# Altium schematic sheet USB Hub.SchDoc
size A3
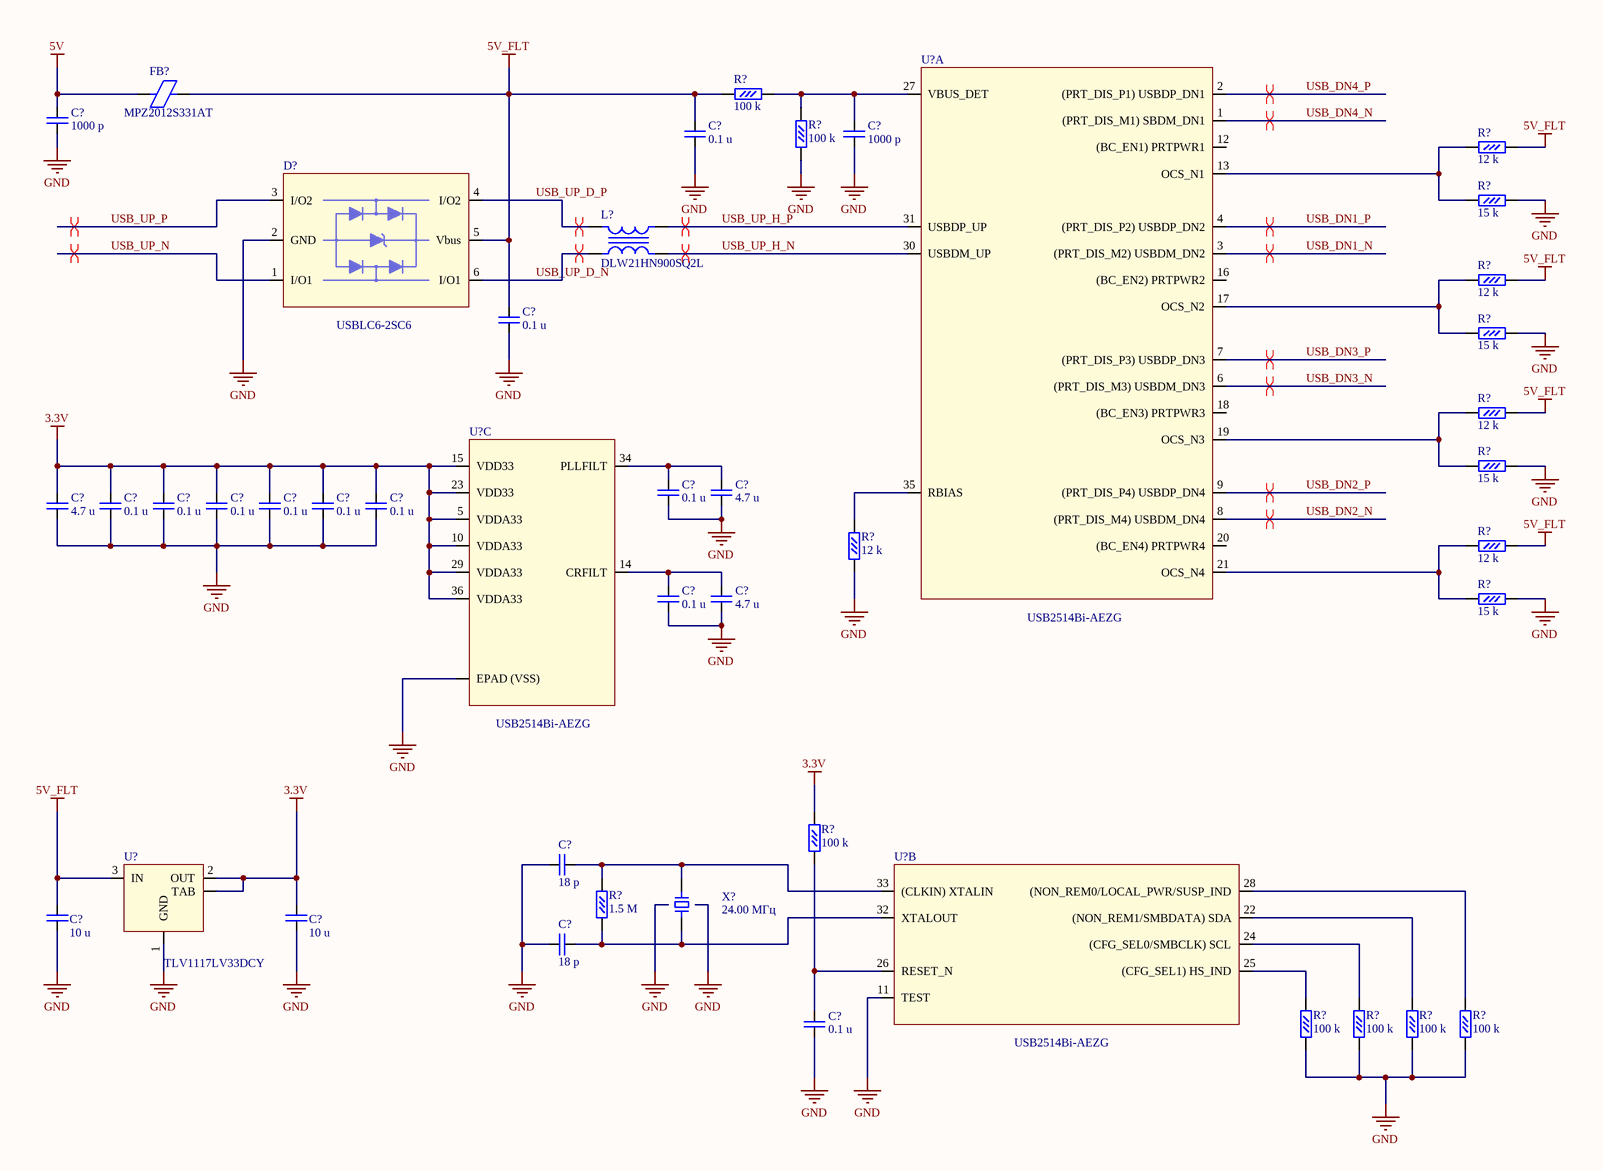
[diagram p0: USB Hub.SchDoc]

## Parts
(Parts that share a designator on the sheet are numbered #1, #2 ... from top to bottom, then left to right.)
C?#1  value 1000 p  [C0402]  (hidden comment: Конденсатор SMD, 1000пФ, X7R, 50В, 10%, 0402)
C?#2  value 0.1 u  [C0402]  (hidden comment: Конденсатор SMD, 0.1мкФ, X5R, 25В, 10%, 0402)
C?#3  value 1000 p  [C0402]  (hidden comment: Конденсатор SMD, 1000пФ, X7R, 50В, 10%, 0402)
C?#4  value 0.1 u  [C0402]  (hidden comment: Конденсатор SMD, 0.1мкФ, X5R, 25В, 10%, 0402)
C?#5  value 0.1 u  [C0402]  (hidden comment: Конденсатор SMD, 0.1мкФ, X5R, 25В, 10%, 0402)
C?#6  value 4.7 u  [C0805]  (hidden comment: Конденсатор SMD, 4.7мкФ, X5R, 50В, 10%, 0805)
C?#7  value 4.7 u  [C0805]  (hidden comment: Конденсатор SMD, 4.7мкФ, X5R, 50В, 10%, 0805)
C?#8  value 0.1 u  [C0402]  (hidden comment: Конденсатор SMD, 0.1мкФ, X5R, 25В, 10%, 0402)
C?#9  value 0.1 u  [C0402]  (hidden comment: Конденсатор SMD, 0.1мкФ, X5R, 25В, 10%, 0402)
C?#10  value 0.1 u  [C0402]  (hidden comment: Конденсатор SMD, 0.1мкФ, X5R, 25В, 10%, 0402)
C?#11  value 0.1 u  [C0402]  (hidden comment: Конденсатор SMD, 0.1мкФ, X5R, 25В, 10%, 0402)
C?#12  value 0.1 u  [C0402]  (hidden comment: Конденсатор SMD, 0.1мкФ, X5R, 25В, 10%, 0402)
C?#13  value 0.1 u  [C0402]  (hidden comment: Конденсатор SMD, 0.1мкФ, X5R, 25В, 10%, 0402)
C?#14  value 0.1 u  [C0402]  (hidden comment: Конденсатор SMD, 0.1мкФ, X5R, 25В, 10%, 0402)
C?#15  value 4.7 u  [C0805]  (hidden comment: Конденсатор SMD, 4.7мкФ, X5R, 50В, 10%, 0805)
C?#16  value 18 p  [C0402]  (hidden comment: Конденсатор SMD, 18пФ, NP0, 50В, 5%, 0402)
C?#17  value 10 u  [C0805]  (hidden comment: Конденсатор SMD, 10мкФ, X5R, 25В, 10%, 0805)
C?#18  value 10 u  [C0805]  (hidden comment: Конденсатор SMD, 10мкФ, X5R, 25В, 10%, 0805)
C?#19  value 18 p  [C0402]  (hidden comment: Конденсатор SMD, 18пФ, NP0, 50В, 5%, 0402)
C?#20  value 0.1 u  [C0402]  (hidden comment: Конденсатор SMD, 0.1мкФ, X5R, 25В, 10%, 0402)
D?  Диод, USBLC6-2SC6  [SOT23-6L]  (value not drawn)
FB?  Фильтр ЭМС, MPZ2012S331AT  [I0805]  (value not drawn)
L?  PartNumber: DLW21HN900SQ2L  [DLW21H]  (hidden comment: Фильтр ЭМС, DLW21HN900SQ2L)
R?#1  value 100 k  [R0402]  (hidden comment: Резистор SMD, 0.063Вт, 0402, 100кОм, 1 %)
R?#2  value 100 k  [R0402]  (hidden comment: Резистор SMD, 0.063Вт, 0402, 100кОм, 1 %)
R?#3  value 12 k  [R0402]  (hidden comment: Резистор SMD, 0.063Вт, 0402, 12кОм, 1 %)
R?#4  value 15 k  [R0402]  (hidden comment: Резистор SMD, 0.063Вт, 0402, 15кОм, 1 %)
R?#5  value 12 k  [R0402]  (hidden comment: Резистор SMD, 0.063Вт, 0402, 12кОм, 1 %)
R?#6  value 15 k  [R0402]  (hidden comment: Резистор SMD, 0.063Вт, 0402, 15кОм, 1 %)
R?#7  value 12 k  [R0402]  (hidden comment: Резистор SMD, 0.063Вт, 0402, 12кОм, 1 %)
R?#8  value 15 k  [R0402]  (hidden comment: Резистор SMD, 0.063Вт, 0402, 15кОм, 1 %)
R?#9  value 12 k  [R0402]  (hidden comment: Резистор SMD, 0.063Вт, 0402, 12кОм, 1 %)
R?#10  value 12 k  [R0402]  (hidden comment: Резистор SMD, 0.063Вт, 0402, 12кОм, 1 %)
R?#11  value 15 k  [R0402]  (hidden comment: Резистор SMD, 0.063Вт, 0402, 15кОм, 1 %)
R?#12  value 100 k  [R0402]  (hidden comment: Резистор SMD, 0.063Вт, 0402, 100кОм, 1 %)
R?#13  value 1.5 M  [R0402]  (hidden comment: Резистор SMD, 0.063Вт, 0402, 1.5МОм, 1 %)
R?#14  value 100 k  [R0402]  (hidden comment: Резистор SMD, 0.063Вт, 0402, 100кОм, 1 %)
R?#15  value 100 k  [R0402]  (hidden comment: Резистор SMD, 0.063Вт, 0402, 100кОм, 1 %)
R?#16  value 100 k  [R0402]  (hidden comment: Резистор SMD, 0.063Вт, 0402, 100кОм, 1 %)
R?#17  value 100 k  [R0402]  (hidden comment: Резистор SMD, 0.063Вт, 0402, 100кОм, 1 %)
U?#1  Микросхема, USB2514Bi-AEZG  [QFN36_Microchip_6x6mm_EP_3.7x3.7mm]  (value not drawn)  (part A of 3)
U?#2  Микросхема, USB2514Bi-AEZG  [QFN36_Microchip_6x6mm_EP_3.7x3.7mm]  (value not drawn)  (part C of 3)
U?#3  Микросхема, TLV1117LV33DCY  [SOT223]  (value not drawn)
U?#4  Микросхема, USB2514Bi-AEZG  [QFN36_Microchip_6x6mm_EP_3.7x3.7mm]  (value not drawn)  (part B of 3)
X?  Frequency: 24.00 МГц  [QSMD_32x25_KX-7]  (hidden comment: Кварцевый резонатор, 24.00 МГц, KX-7T)

## Nets
3.3V: C?#7.2 C?#8.1 C?#9.1 C?#10.1 C?#11.1 C?#12.1 C?#13.1 C?#18.2 R?#12.1 U?#2.5(VDDA33) U?#2.10(VDDA33) U?#2.15(VDD33) U?#2.23(VDD33) U?#2.29(VDDA33) U?#2.36(VDDA33) U?#3.2(OUT) U?#3.4(TAB)
5V: C?#1.2 FB?.1
5V_FLT: C?#2.1 C?#4.1 C?#17.2 D?.5(Vbus) FB?.2 R?#1.2 R?#3.1 R?#5.1 R?#7.1 R?#10.1 U?#3.3(IN)
GND: C?#1.1 C?#2.2 C?#3.1 C?#4.2 C?#5.2 C?#6.1 C?#7.1 C?#8.2 C?#9.2 C?#10.2 C?#11.2 C?#12.2 C?#13.2 C?#14.2 C?#15.1 C?#16.1 C?#17.1 C?#18.1 C?#19.1 C?#20.2 D?.2(GND) R?#2.2 R?#4.1 R?#6.1 R?#8.1 R?#9.2 R?#11.1 R?#14.2 R?#15.2 R?#16.2 R?#17.2 U?#2.0(EPAD_(VSS)) U?#3.1(GND) U?#4.11(TEST) X?.2 X?.4
USB_DN1_N: U?#1.3((PRT_DIS_M2)_USBDM_DN2)
USB_DN1_P: U?#1.4((PRT_DIS_P2)_USBDP_DN2)
USB_DN2_N: U?#1.8((PRT_DIS_M4)_USBDM_DN4)
USB_DN2_P: U?#1.9((PRT_DIS_P4)_USBDP_DN4)
USB_DN3_N: U?#1.6((PRT_DIS_M3)_USBDM_DN3)
USB_DN3_P: U?#1.7((PRT_DIS_P3)_USBDP_DN3)
USB_DN4_N: U?#1.1((PRT_DIS_M1)_SBDM_DN1)
USB_DN4_P: U?#1.2((PRT_DIS_P1)_USBDP_DN1)
USB_UP_D_N: D?.6(I/O1) L?.2
USB_UP_D_P: D?.4(I/O2) L?.3
USB_UP_H_N: L?.1 U?#1.30(USBDM_UP)
USB_UP_H_P: L?.4 U?#1.31(USBDP_UP)
USB_UP_N: D?.1(I/O1)
USB_UP_P: D?.3(I/O2)
NetC?#3_2: C?#3.2 R?#1.1 R?#2.1 U?#1.27(VBUS_DET)
NetC?#5_1: C?#5.1 C?#6.2 U?#2.34(PLLFILT)
NetC?#14_1: C?#14.1 C?#15.2 U?#2.14(CRFILT)
NetC?#16_2: C?#16.2 R?#13.1 U?#4.33((CLKIN)_XTALIN) X?.3
NetC?#19_2: C?#19.2 R?#13.2 U?#4.32(XTALOUT) X?.1
NetC?#20_1: C?#20.1 R?#12.2 U?#4.26(RESET_N)
NetR?#3_2: R?#3.2 R?#4.2 U?#1.13(OCS_N1)
NetR?#5_2: R?#5.2 R?#6.2 U?#1.17(OCS_N2)
NetR?#7_2: R?#7.2 R?#8.2 U?#1.19(OCS_N3)
NetR?#9_1: R?#9.1 U?#1.35(RBIAS)
NetR?#10_2: R?#10.2 R?#11.2 U?#1.21(OCS_N4)
NetR?#14_1: R?#14.1 U?#4.25((CFG_SEL1)_HS_IND)
NetR?#15_1: R?#15.1 U?#4.24((CFG_SEL0/SMBCLK)_SCL)
NetR?#16_1: R?#16.1 U?#4.22((NON_REM1/SMBDATA)_SDA)
NetR?#17_1: R?#17.1 U?#4.28((NON_REM0/LOCAL_PWR/SUSP_IND)

Not connected (* = marked no-connect by the designer): U?#1 12((BC_EN1)_PRTPWR1) 16((BC_EN2)_PRTPWR2) 18((BC_EN3)_PRTPWR3) 20((BC_EN4)_PRTPWR4)

## Layout directives
differential pair: USB_DN1_N, USB_DN1_P, USB_DN2_N, USB_DN2_P, USB_DN3_N, USB_DN3_P, USB_DN4_N, USB_DN4_P, USB_UP_D_N, USB_UP_D_P, USB_UP_H_N, USB_UP_H_P, USB_UP_N, USB_UP_P

## Library data of the parts
C?#1-C?#5 C?#8-C?#14 C?#16 C?#19 C?#20 = C0402: Chip Capacitor 0402; Family: Конденсатор SMD; Package: 0402
  C?#1 C?#3: Voltage: 50В; Tolerance: 10%; TemperatureCoeff: X7R; Capacitance: 1000пФ
  C?#2 C?#4 C?#5 C?#8-C?#14 C?#20: Voltage: 25В; Tolerance: 10%; TemperatureCoeff: X5R; Capacitance: 0.1мкФ
  C?#16 C?#19: Voltage: 50В; Tolerance: 5%; TemperatureCoeff: NP0; Capacitance: 18пФ
C?#6 C?#7 C?#15 C?#17 C?#18 = C0805: Chip Capacitor 0805; Tolerance: 10%; TemperatureCoeff: X5R; Family: Конденсатор SMD; Package: 0805
  C?#6 C?#7 C?#15: Voltage: 50В; Capacitance: 4.7мкФ
  C?#17 C?#18: Voltage: 25В; Capacitance: 10мкФ
D? = USBLC6-2SC6: Very low capacitance ESD protection; Manufacturer: STMicroelectronics; Family: Диод; PartNumber: USBLC6-2SC6
FB? = MPZ2012S331AT: Chip Ferrite Bead 0805 (2012); Manufacturer: TDK; Max DC Current: 2.5 A; DC Resistance: 50 mOhm; Impedance: 330 Ohm; Family: Фильтр ЭМС; PartNumber: MPZ2012S331AT
L? = DLW21H: 2 Line Common Mode Choke; Manufacturer: Murata; Family: Фильтр ЭМС
R?#1-R?#17 = R0402_0.063: Chip Resistor 0402, 0.063 W; Tolerance: 1 %; Power: 0.063Вт; Family: Резистор SMD; Package: 0402
  R?#1 R?#2 R?#12 R?#14-R?#17: Resistance: 100кОм
  R?#3 R?#5 R?#7 R?#9 R?#10: Resistance: 12кОм
  R?#4 R?#6 R?#8 R?#11: Resistance: 15кОм
  R?#13: Resistance: 1.5МОм
U?#1 U?#2 U?#4 = USB2514Bi-AEZG: USB 2.0 Hi-Speed Hub Controller (4 downstream ports); Manufacturer: Microchip; Family: Микросхема; PartNumber: USB2514Bi-AEZG
U?#3 = TLV1117LV33DCY: 1-A, Positive Fixed-Voltage, Low-Dropout Regulator; Manufacturer: Texas Instruments; Family: Микросхема; PartNumber: TLV1117LV33DCY
X? = KX-7T: Quartz Crystal; Manufacturer: Geyer Electronic; Family: Кварцевый резонатор; PartNumber: KX-7T